# Altium schematic sheet sensor-4.SchDoc
size Letter
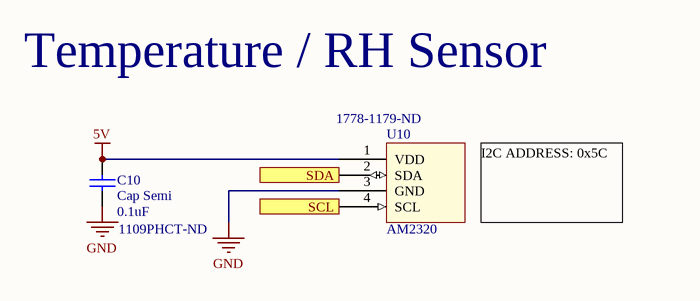
[diagram p0: sensor-4.SchDoc]

## Parts
C10  Cap Semi  value 0.1uF  Supplier Part Number 1: 1109PHCT-ND  [A104K15X7RF5TAA]
U10  AM2320  Supplier Part Number 1: 1778-1179-ND  [AM2320]

## Ports
SCL, SDA

## Nets
5V: C10.2 U10.1(VDD)
GND: C10.1 U10.3(GND)
SCL: U10.4(SCL) ; port SCL
SDA: U10.2(SDA) ; port SDA

## Notes on the sheet
- Temperature / RH Sensor
- I2C ADDRESS: 0x5C

## Library data of the parts
C10 = Cap Semi: Capacitor (Semiconductor SIM Model); Manufacturer: Vishay BCcomponents; Capacitance: 100nF; Voltage Rating: 50V; Tolerance: 10%; Dielectric: X7R; Lead Length: 24.3mm; Lead Diameter: 0.5mm; Published: 8-Jun-2000; LatestRevisionDate: 29-May-2009; LatestRevisionNote: IPC-7351 Footprint Added.; PackageReference: C1206; Publisher: Altium Limited; PackageDescription: Chip Capacitor; Supplier 1: Digi-Key; Manufacturer Part Number: A104K15X7RF5TAA; Stock 1: 502711; Pricing 1: 1=0.24000, 10=0.16500, 100=0.09350, 500=0.06598, 1000=0.05773, 2500=0.05498 (USD); RoHS: Yes; Mount: Through Hole,PCB,Axial; Case/Package: Dipped; Contact Plating: Tin; Min Operating Temperature: -55°C; Max Operating Temperature: 125°C; Package Quantity: 1; Packaging: Tape and Reel; Voltage Rating (DC): 50V; Termination: Axial; Voltage: 50V; Diameter: 2.5mm; Length: 3.8mm; Radiation Hardening: No; REACH SVHC: Unknown; Lead Free: Lead Free; ComponentLink1URL: https://datasheet.ciiva.com/145/aseries-145936.pdf?src-supplier=Digi-Key; ComponentLink1Description: https://datasheet.ciiva.com/145/aseries-145936.pdf?src-supplier=Digi-Key; ComponentLink2URL: https://datasheet.ciiva.com/5815/1734588-5815375.pdf?src-supplier=Farnell; ComponentLink2Description: https://datasheet.ciiva.com/5815/1734588-5815375.pdf?src-supplier=Farnell; ComponentLink3URL: https://datasheet.ciiva.com/18442/70122957-18442089.pdf?src-supplier=Allied+Electronics; ComponentLink3Description: https://datasheet.ciiva.com/18442/70122957-18442089.pdf?src-supplier=Allied+Electronics; ComponentLink4URL: https://datasheet.ciiva.com/2988/aseries-2988250.pdf?src-supplier=Avnet; ComponentLink4Description: https://datasheet.ciiva.com/2988/aseries-2988250.pdf?src-supplier=Avnet; ComponentLink5URL: https://datasheet.ciiva.com/17444/aseries-17444908.pdf?src-supplier=Avnet+Europe; ComponentLink5Description: https://datasheet.ciiva.com/17444/aseries-17444908.pdf?src-supplier=Avnet+Europe; ComponentLink6URL: https://datasheet.ciiva.com/46418/1796772-46418252.pdf?src-supplier=Element14; ComponentLink6Description: https://datasheet.ciiva.com/46418/1796772-46418252.pdf?src-supplier=Element14; ComponentLink7URL: https://datasheet.ciiva.com/145/aseries-145935.pdf?src-supplier=Digi-Key; ComponentLink7Description: https://datasheet.ciiva.com/145/aseries-145935.pdf?src-supplier=Digi-Key
U10 = AM2320: Humidity Temperature Sensor 10 ~ 99% RH I²C ±3% RH 5s Through Hole; Manufacturer: Pimoroni; Manufacturer Part Number: COM1700; Supplier 1: Digi-Key; Stock 1: 149; Pricing 1: 1=3.76000 (USD); RoHS: No